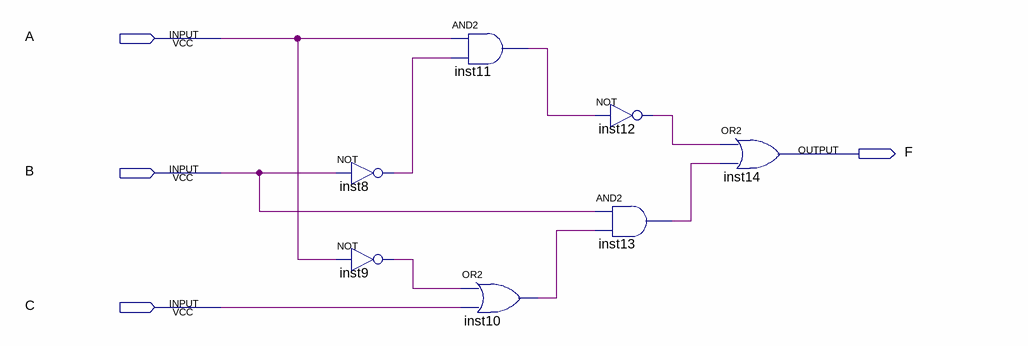
[diagram p0: schematic sheet]
// Quartus schematic Question3.bdf as structural Verilog: 7 symbols, 4 pins
module Question3 (
  input  A,
  input  B,
  input  C,
  output F
);

  wire inst8_out, inst9_out, inst10_out, inst11_out, inst12_out, inst13_out;

  not inst8 (inst8_out, B);
  not inst9 (inst9_out, A);
  and inst11 (inst11_out, A, inst8_out);
  or inst10 (inst10_out, inst9_out, C);
  not inst12 (inst12_out, inst11_out);
  and inst13 (inst13_out, B, inst10_out);
  or inst14 (F, inst12_out, inst13_out);
endmodule
